# Altium project Diana.PrjPCB
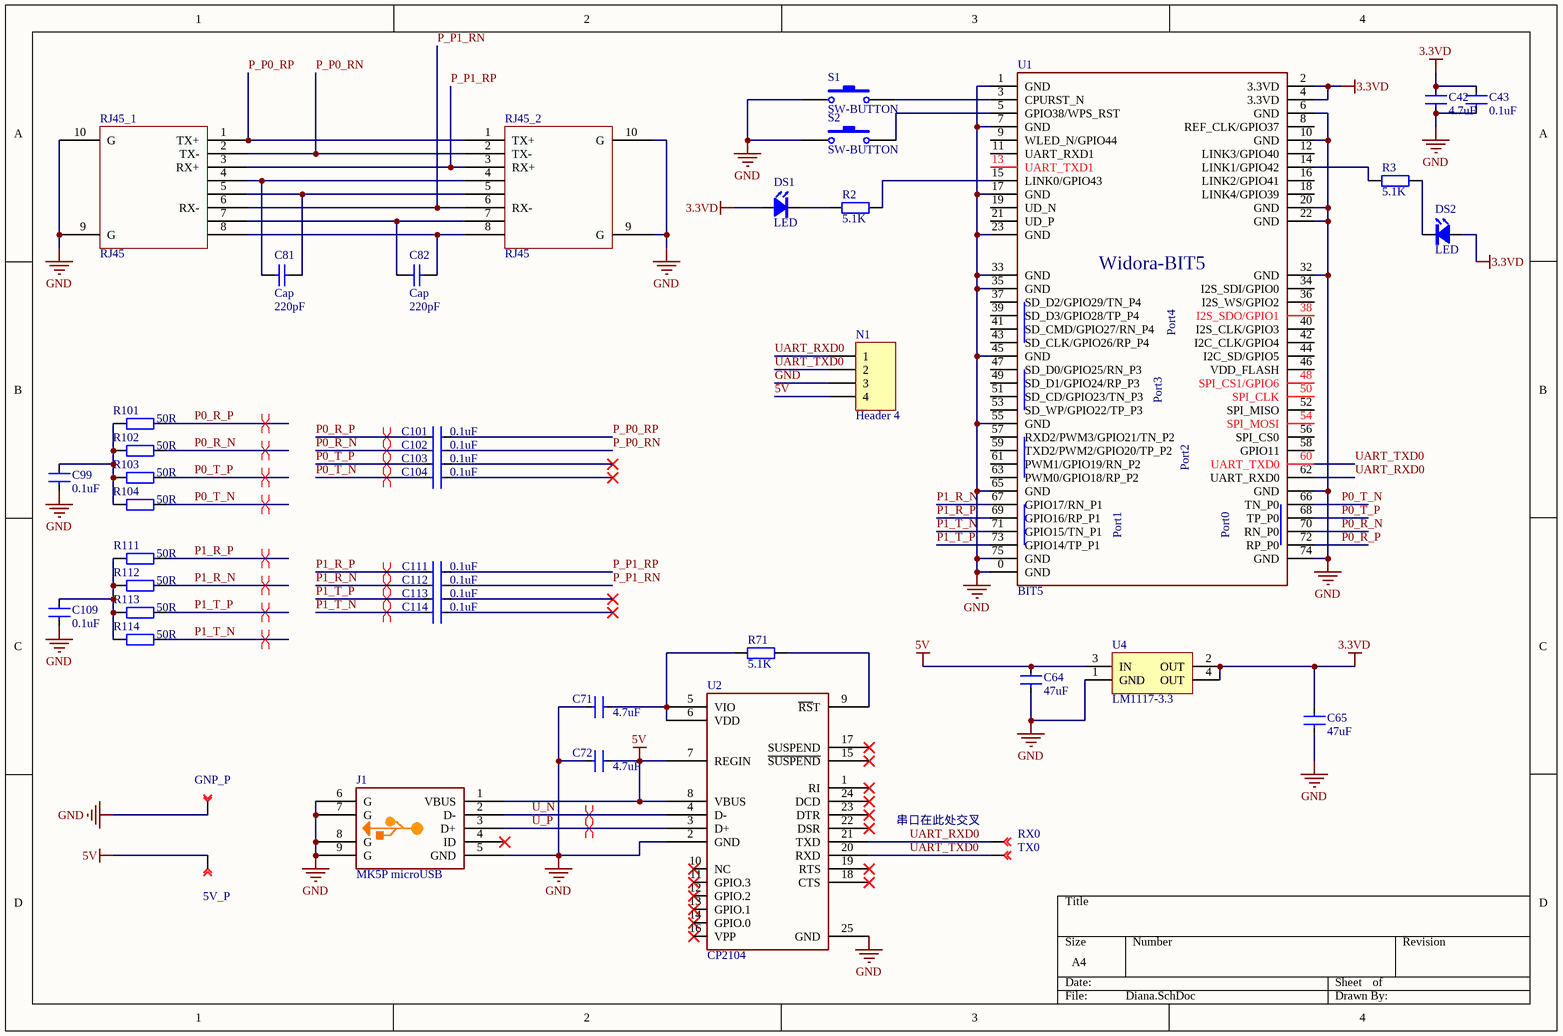
[diagram p0: Diana.SchDoc]
1 sheet, 44 parts. Net scope: global (net labels, ports and power ports of the same name join across sheets).
Board file: Diana.PcbDoc

## Sheet Diana.SchDoc
size A4

### Parts
5V_P  TEST POINT  [TEST-POINT]  (value not drawn)
C42  4.7uF  [C0402]
C43  0.1uF  [C0402]
C64  47uF  [0805C]
C65  47uF  [0805C]
C71  4.7uF  [C0402]
C72  4.7uF  [C0402]
C81  Cap  value 220pF  [C0402]
C82  Cap  value 220pF  [C0402]
C99  0.1uF  [C0402]
C101  0.1uF  [C0402]
C102  0.1uF  [C0402]
C103  0.1uF  [C0402]
C104  0.1uF  [C0402]
C109  0.1uF  [C0402]
C111  0.1uF  [C0402]
C112  0.1uF  [C0402]
C113  0.1uF  [C0402]
C114  0.1uF  [C0402]
DS1  LED  [LED0603]
DS2  LED  [LED0603]
GNP_P  TEST POINT  [TEST-POINT]  (value not drawn)
J1  MK5P microUSB  [MICROUSB]
N1  Header 4  [HDR-1X4]
R2  5.1K  [R0402]
R3  5.1K  [R0402]
R71  5.1K  [R0402]
R101  50R  [R0402]
R102  50R  [R0402]
R103  50R  [R0402]
R104  50R  [R0402]
R111  50R  [R0402]
R112  50R  [R0402]
R113  50R  [R0402]
R114  50R  [R0402]
RJ45_1  RJ45  [RJ45]
RJ45_2  RJ45  [RJ45]
RX0  TEST POINT  [TEST-POINT]  (value not drawn)
S1  SW-BUTTON  [MINIBUTTON]
S2  SW-BUTTON  [MINIBUTTON]
TX0  TEST POINT  [TEST-POINT]  (value not drawn)
U1  BIT5  [NGFF_M_2-EKEY]
U2  CP2104  [QFN24]
U4  LM1117-3.3  [SOT223-4N]

### Nets
3.3VD: C42.1 C43.1 C65.2 DS1.A DS2.A U1.2(3.3VD) U1.4(3.3VD) U4.2(OUT) U4.4(OUT)
5V: 5V_P.1 C64.1 C72.2 J1.1(VBUS) N1.4 U2.7(REGIN) U2.8(VBUS) U4.3(IN)
GND: C42.2 C43.2 C64.2 C65.1 C71.2 C72.1 C99.2 C109.2 GNP_P.1 J1.5(GND) J1.6(G) J1.7(G) J1.8(G) J1.9(G) N1.3 RJ45_1.9(G) RJ45_1.10(G) RJ45_2.9(G) RJ45_2.10(G) S1.1 S2.1 U1.0(GND) U1.1(GND) U1.6(GND) U1.7(GND) U1.10(GND) U1.17(GND) U1.20(GND) U1.22(GND) U1.23(GND) U1.32(GND) U1.33(GND) U1.35(GND) U1.45(GND) U1.55(GND) U1.64(GND) U1.65(GND) U1.74(GND) U1.75(GND) U2.2(GND) U2.25(GND) U4.1(GND)
P0_R_N: C102.1 R102.2 U1.70(RN_P0)
P0_R_P: C101.1 R101.2 U1.72(RP_P0)
P0_T_N: C104.1 R104.2 U1.66(TN_P0)
P0_T_P: C103.1 R103.2 U1.68(TP_P0)
P1_R_N: C112.1 R112.2 U1.67(GPIO17/RN_P1)
P1_R_P: C111.1 R111.2 U1.69(GPIO16/RP_P1)
P1_T_N: C114.1 R114.2 U1.71(GPIO15/TN_P1)
P1_T_P: C113.1 R113.2 U1.73(GPIO14/TP_P1)
P_P0_RN: C102.2 RJ45_1.2(TX-) RJ45_2.2(TX-)
P_P0_RP: C101.2 RJ45_1.1(TX+) RJ45_2.1(TX+)
P_P1_RN: C112.2 RJ45_1.6(RX-) RJ45_2.6(RX-)
P_P1_RP: C111.2 RJ45_1.3(RX+) RJ45_2.3(RX+)
U_N: J1.2(D-) U2.4(D-)
U_P: J1.3(D+) U2.3(D+)
UART_RXD0: N1.1 RX0.1 U1.62(UART_RXD0) U2.21(TXD)
UART_TXD0: N1.2 TX0.1 U1.60(UART_TXD0) U2.20(RXD)
NetC71_1: C71.1 R71.1 U2.5(VIO) U2.6(VDD)
NetC81_1: C81.1 RJ45_1.4 RJ45_2.4
NetC81_2: C81.2 RJ45_1.5 RJ45_2.5
NetC82_1: C82.1 RJ45_1.7 RJ45_2.7
NetC82_2: C82.2 RJ45_1.8 RJ45_2.8
NetC99_1: C99.1 R101.1 R102.1 R103.1 R104.1
NetC109_1: C109.1 R111.1 R112.1 R113.1 R114.1
NetDS1_K: DS1.K R2.1
NetDS2_K: DS2.K R3.2
NetR2_2: R2.2 U1.15(LINK0/GPIO43)
NetR3_1: R3.1 U1.14(LINK1/GPIO42)
NetR71_2: R71.2 U2.9(~{RS}T)
NetS1_2: S1.2 U1.3(CPURST_N)
NetS2_2: S2.2 U1.5(GPIO38/WPS_RST)

Not connected (* = marked no-connect by the designer): C103 2*; C104 2*; C113 2*; C114 2*; J1 4(ID)*; U1 8(REF_CLK/GPIO37) 9(WLED_N/GPIO44) 11(UART_RXD1) 12(LINK3/GPIO40) 13(UART_TXD1) 16(LINK2/GPIO41) 18(LINK4/GPIO39) 19(UD_N) 21(UD_P) 34(I2S_SDI/GPIO0) 36(I2S_WS/GPIO2) 37(SD_D2/GPIO29/TN_P4) 38(I2S_SDO/GPIO1) 39(SD_D3/GPIO28/TP_P4) 40(I2S_CLK/GPIO3) 41(SD_CMD/GPIO27/RN_P4) 42(I2C_CLK/GPIO4) 43(SD_CLK/GPIO26/RP_P4) 44(I2C_SD/GPIO5) 46(VDD_FLASH) 47(SD_D0/GPIO25/RN_P3) 48(SPI_CS1/GPIO6) 49(SD_D1/GPIO24/RP_P3) 50(SPI_CLK) 51(SD_CD/GPIO23/TN_P3) 52(SPI_MISO) 53(SD_WP/GPIO22/TP_P3) 54(SPI_MOSI) 56(SPI_CS0) 57(RXD2/PWM3/GPIO21/TN_P2) 58(GPIO11) 59(TXD2/PWM2/GPIO20/TP_P2) 61(PWM1/GPIO19/RN_P2) 63(PWM0/GPIO18/RP_P2); U2 1(RI)* 10(NC)* 11(GPIO.3)* 12(GPIO.2)* 13(GPIO.1)* 14(GPIO.0)* 15(~{SUSPEND})* 16(VPP)* 17(SUSPEND)* 18(CTS)* 19(RTS)* 22(DSR)* 23(DTR)* 24(DCD)*

### Layout directives
differential pair: P0_R_N, P0_R_P, P0_T_N, P0_T_P, P1_R_N, P1_R_P, P1_T_N, P1_T_P, U_N, U_P

### Notes on the sheet
- 串口在此处交叉
- (in symbol BIT5) Widora-BIT5; Port4; Port3; Port2; Port1; Port0

### Library data of the parts
5V_P GNP_P RX0 TX0 = TP: Description
C42 C43 C64 C65 C71 C72 C99 C101-C104 C109 C111-C114 = CAP: 普通小电容
C81 C82 = Cap: Capacitor; Published: 8-Jun-2000; LatestRevisionDate: 17-Jul-2002; LatestRevisionNote: Re-released for DXP Platform.; PackageReference: RAD-0.3; Publisher: Altium Limited; PackageDescription: Radial Cap, Thru-Hole; 2 Leads; 0.3 in Pin Spacing
DS1 DS2 = LED: RED
J1 = MICRO_USB: 4固定脚microUSB座
N1 = Header 4: Header, 4-Pin; LatestRevisionDate: 17-Jul-2002; LatestRevisionNote: Re-released for DXP Platform.; Publisher: Altium Limited
R2 R3 R71 R101-R104 R111-R114 = RES: 普通电阻
RJ45_1 RJ45_2 = RJ45: RJ45不带网络变压器
U1 = BIT5: NGFF M.2 E KEY
U4 = LM1117-3.3: 800mA and 1A Low Dropout Positive Regulator 2.85V, 3.3V, 5V, and Adjustable; PackageDocument: revC; Published: 8-Jun-2000; LatestRevisionDate: 17-Jul-2002; LatestRevisionNote: Re-released for DXP Platform.; DatasheetDocument: Sep-1997; PackageReference: ZZ311; Publisher: Altium Limited; ComponentLink1Description: Manufacturer Link; ComponentLink1URL: http://www.ti.com/